# Altium schematic sheet 03_USB.SchDoc
size A2; ApprovedBy: DNP; CheckedBy: DNP; Author: DNP; CompanyName: Google LLC; DrawnBy: DNP; Engineer: Bangfei/Michael/Leo; Organization: Google LLC; Address1: 1600 Amphitheatre Parkway; Address2: Mountain View, CA 94043; Address3: DNP; Address4: DNP; DocumentNumber: DNP; Revision: PVT; SheetNumber: 3; SheetTotal: 11; VersionControl_RevNumber: DNP; IsUserConfigurable: DNP; Time: DNP; ImagePath: DNP; Rule: DNP; ProjectName: Enterprise; Application_BuildNumber: DNP
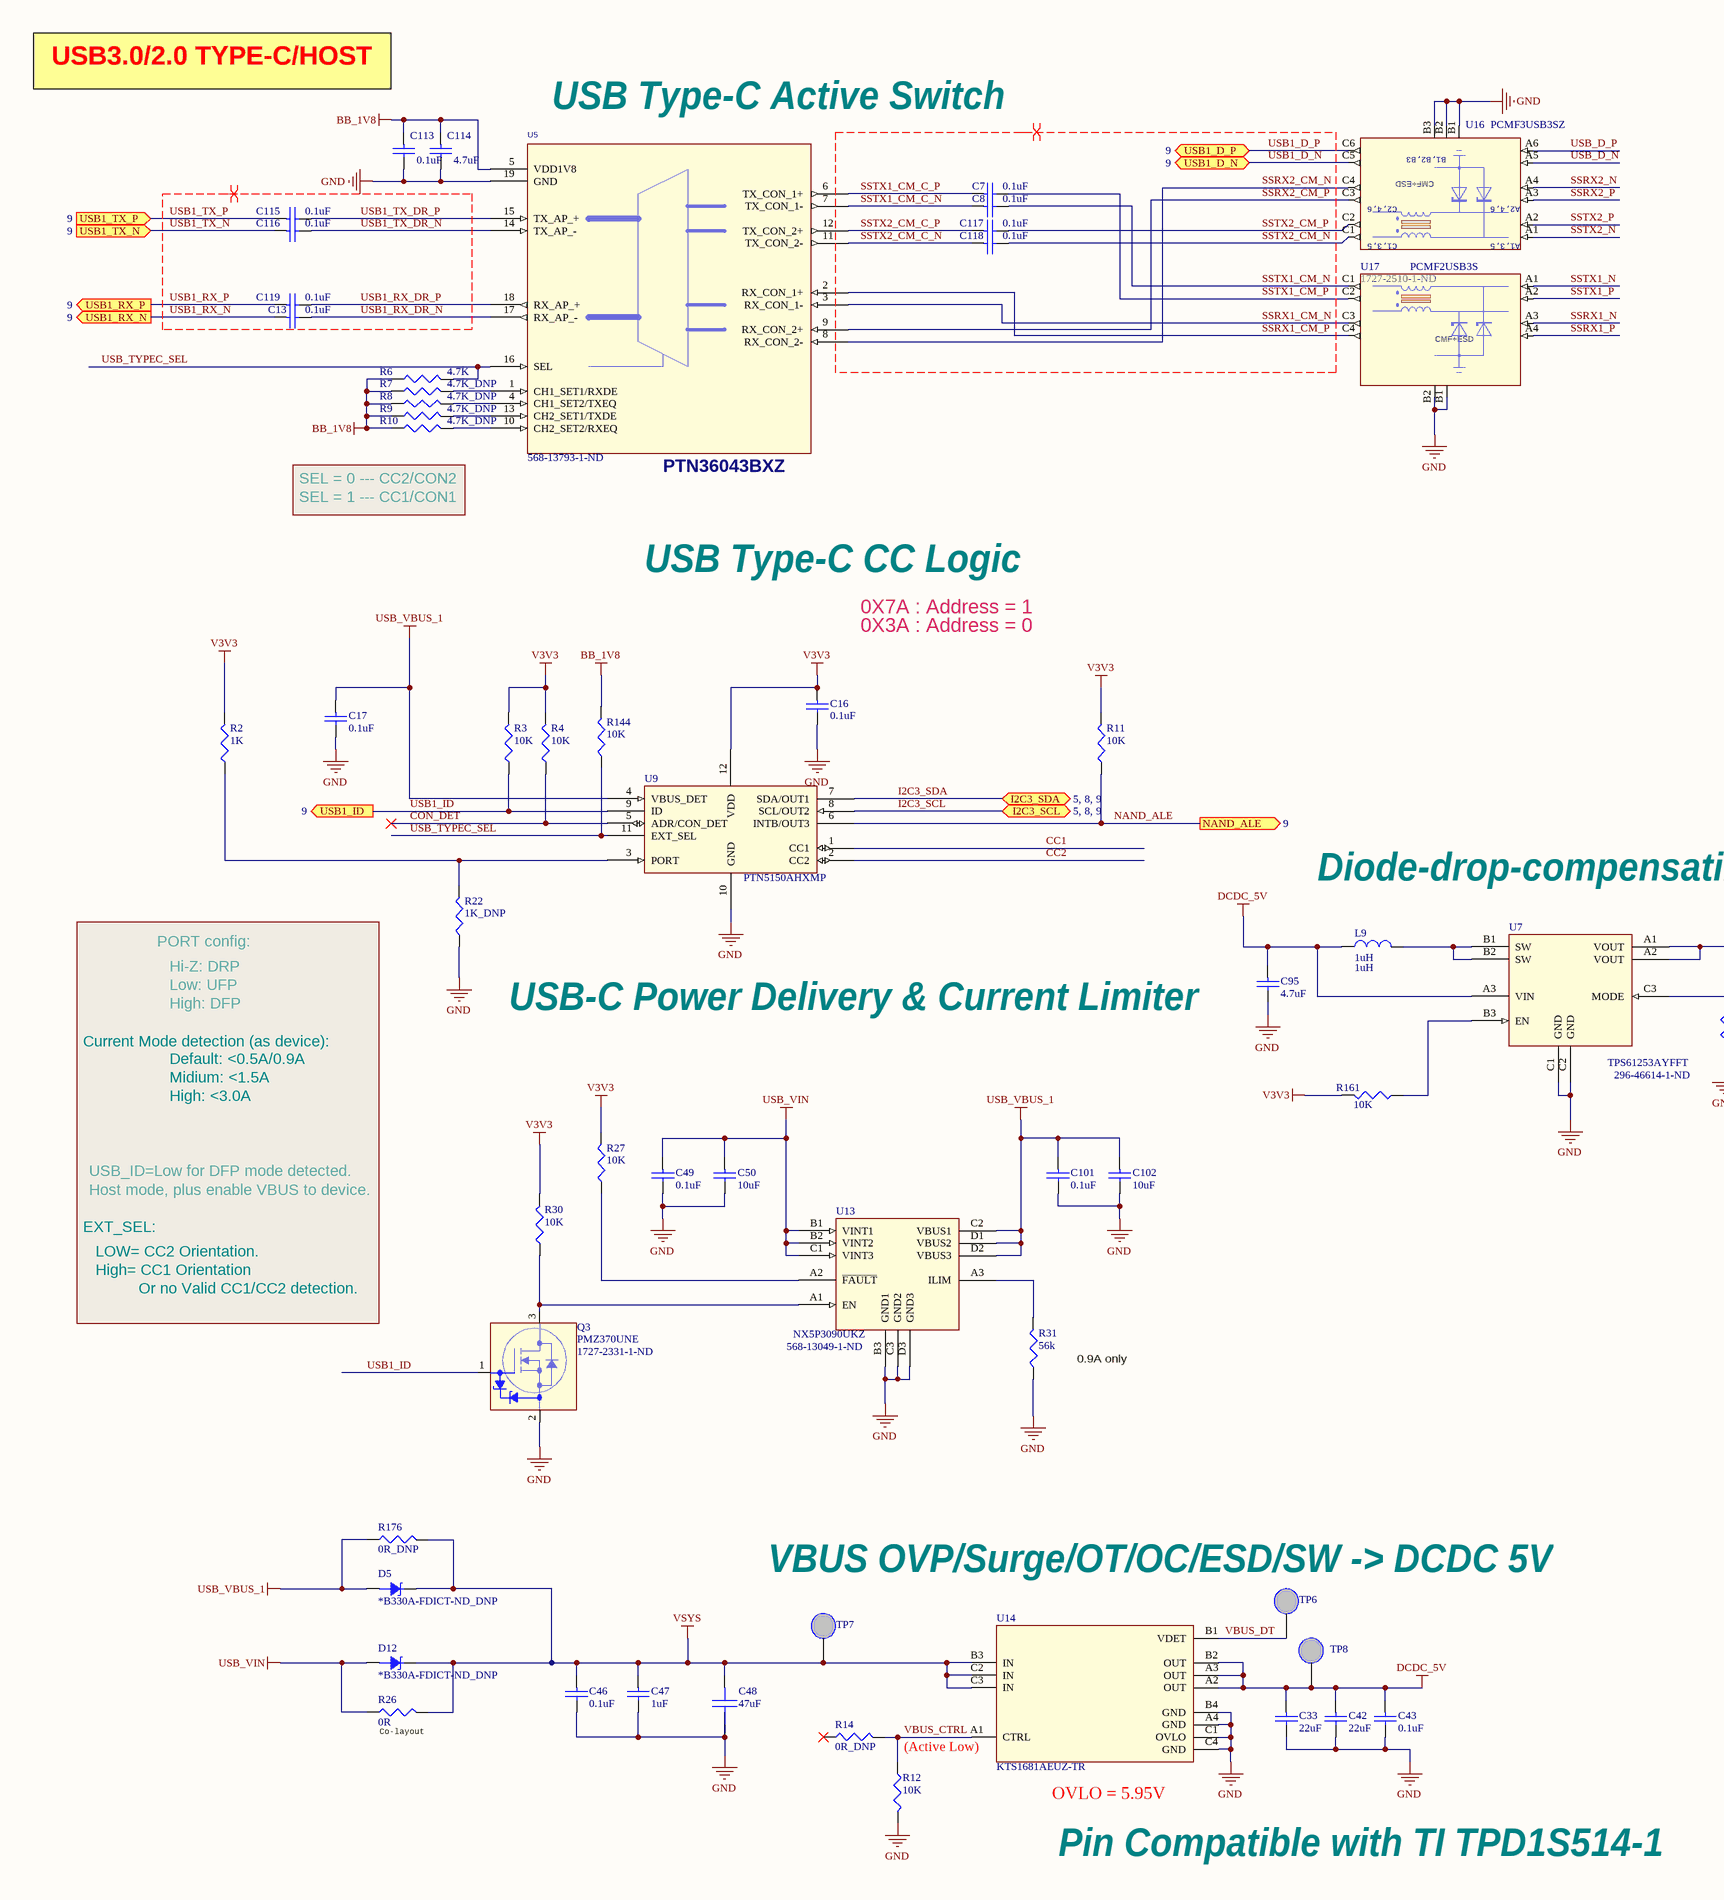
[diagram p0: 03_USB.SchDoc, left]
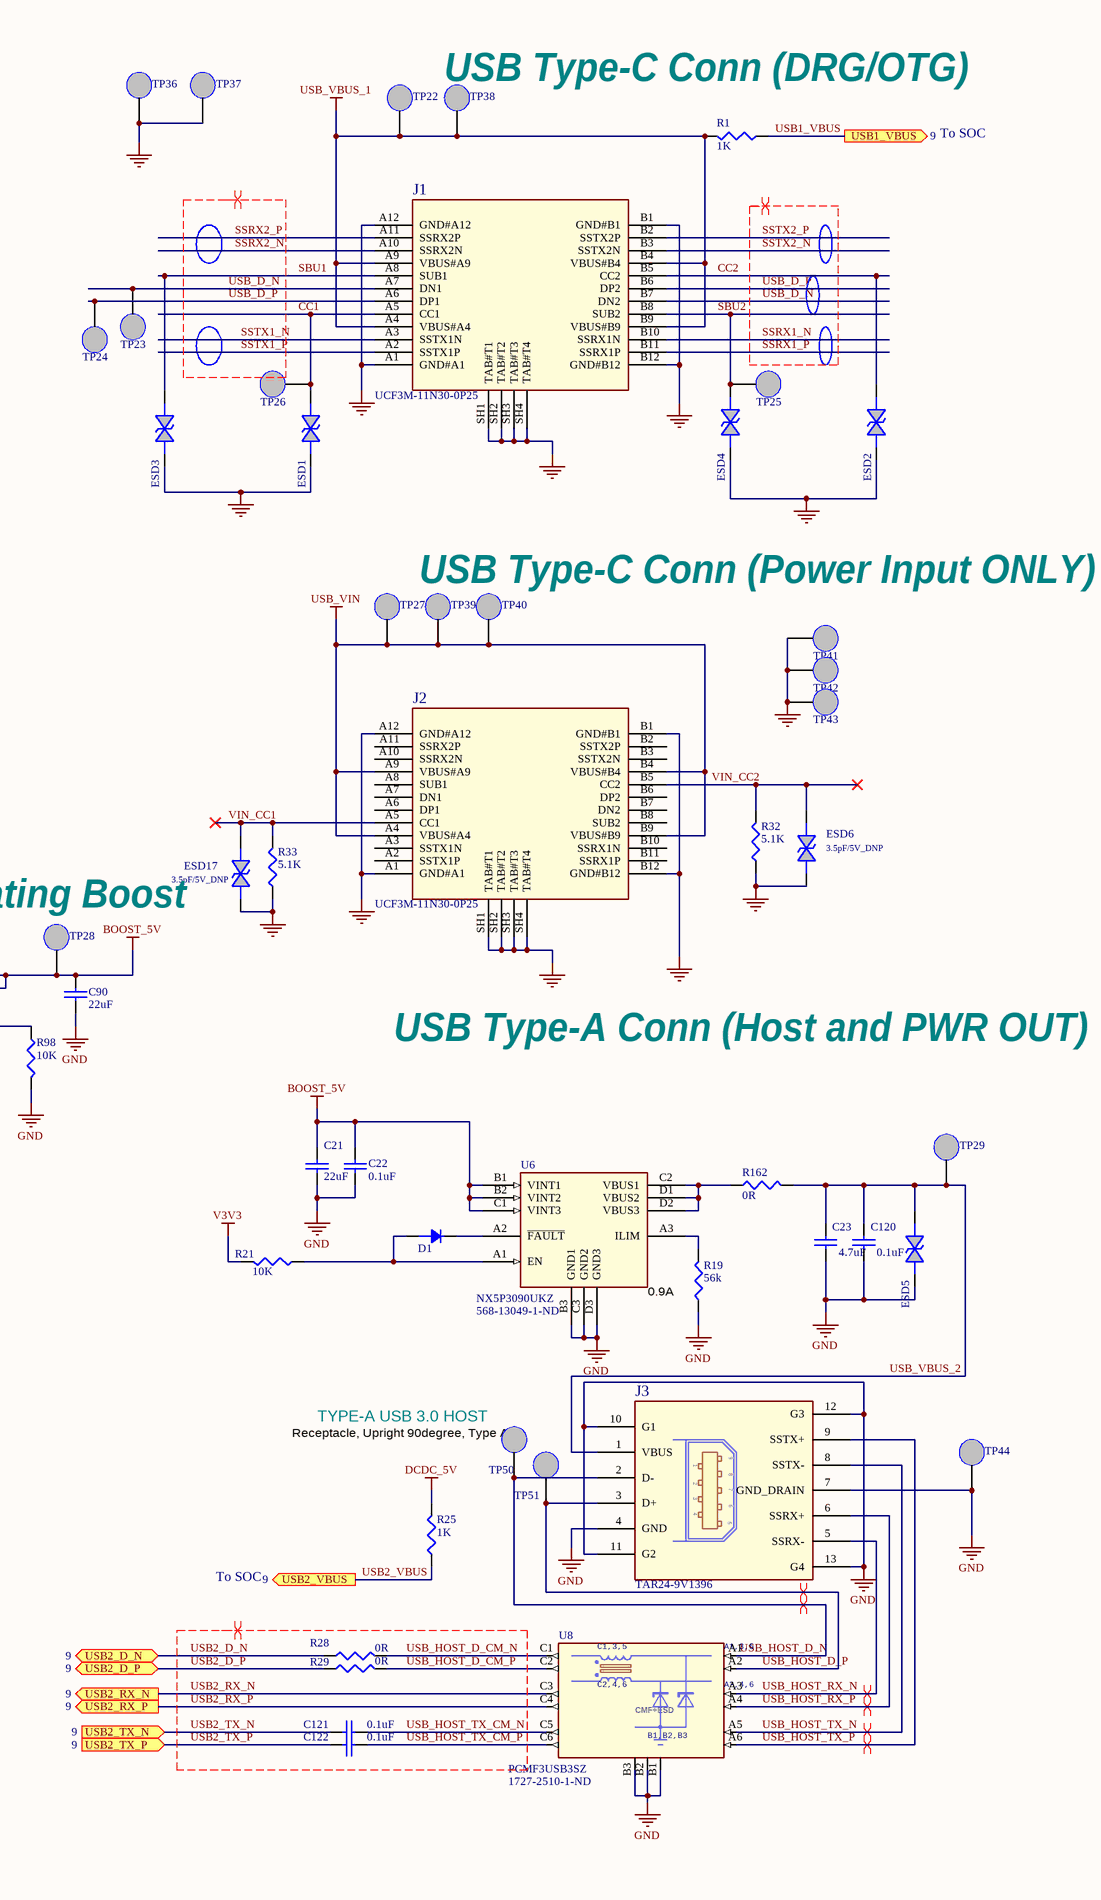
[diagram p1: 03_USB.SchDoc, right]

## Parts
C7  value 0.1uF  [0201]  (hidden comment: 0.1uF/10V)
C8  value 0.1uF  [0201]  (hidden comment: 0.1uF/10V)
C13  value 0.1uF  [0201]  (hidden comment: 0.1uF/10V)
C16  value 0.1uF  [0402]  (hidden comment: 0.1uF/25V)
C17  value 0.1uF  [0402]  (hidden comment: 0.1uF/25V)
C21  value 22uF  [0603]  (hidden comment: 22uF/10V)
C22  value 0.1uF  [0201]  (hidden comment: 0.1uF/10V)
C23  value 4.7uF  [0603]  (hidden comment: 4.7uF/10V)
C33  value 22uF  [0603]  (hidden comment: 22uF/10V)
C42  value 22uF  [0603]  (hidden comment: 22uF/10V)
C43  value 0.1uF  [0201]  (hidden comment: 0.1uF/10V)
C46  value 0.1uF  [0402]  (hidden comment: 0.1uF/25V)
C47  value 1uF  [0402]  (hidden comment: 1uF/25V)
C48  value 47uF  [1206]  (hidden comment: 47uF/25V)
C49  value 0.1uF  [0402]  (hidden comment: 0.1uF/25V)
C50  value 10uF  [0402]  (hidden comment: 10uF/10V)
C90  value 22uF  [0603]  (hidden comment: 10uF/10V)
C95  value 4.7uF  [0603]  (hidden comment: 4.7uF/10V)
C101  value 0.1uF  [0402]  (hidden comment: 0.1uF/25V)
C102  value 10uF  [0402]  (hidden comment: 10uF/10V)
C113  value 0.1uF  [0201]  (hidden comment: 0.1uF/10V)
C114  value 4.7uF  [0402]  (hidden comment: 4.7uF/10V)
C115  value 0.1uF  [0201]  (hidden comment: 0.1uF/10V)
C116  value 0.1uF  [0201]  (hidden comment: 0.1uF/10V)
C117  value 0.1uF  [0201]  (hidden comment: 0.1uF/10V)
C118  value 0.1uF  [0201]  (hidden comment: 0.1uF/10V)
C119  value 0.1uF  [0201]  (hidden comment: 0.1uF/10V)
C120  value 0.1uF  [0201]  (hidden comment: 0.1uF/10V)
C121  value 0.1uF  [0201]  (hidden comment: 0.1uF/10V)
C122  value 0.1uF  [0201]  (hidden comment: 0.1uF/10V)
D1  CUS10F30  [0805-Diode]  (value not drawn)
D5  Supplier Part Number 1: *B330A-FDICT-ND_DNP  [SMA-Diode]  (hidden comment: B330A-FDICT-ND_DNP)
D12  Supplier Part Number 1: *B330A-FDICT-ND_DNP  [SMA-Diode]  (hidden comment: B330A-FDICT-ND_DNP)
ESD1  3.5pF/5V  [0201]  (value not drawn)
ESD2  3.5pF/5V  [0201]  (value not drawn)
ESD3  3.5pF/5V  [0201]  (value not drawn)
ESD4  3.5pF/5V  [0201]  (value not drawn)
ESD5  3.5pF/5V  [0201]  (value not drawn)
ESD6  3.5pF/5V_DNP  [0201]
ESD17  3.5pF/5V_DNP  [0201]
J1  UCF3M-11N30-0P25  [USB12_0_5-UCF3M-11N30-0P25]
J2  UCF3M-11N30-0P25  [USB12_0_5-UCF3M-11N30-0P25]
J3  TAR24-9V1396  [USB9-3_0-TAR24-9V1396]
L9  1uH  [INDC2016X12L]
Q3  PMZ370UNE  Supplier Part Number 1: 1727-2331-1-ND  [DFN10106B]
R1  value 1K  [0201]  (hidden comment: 1K/1%)
R2  value 1K  [0201]  (hidden comment: 1K/1%)
R3  10K  [0201]
R4  10K  [0201]
R6  4.7K  [0201]
R7  value 4.7K_DNP  [0201]  (hidden comment: 4.7K)
R8  value 4.7K_DNP  [0201]  (hidden comment: 4.7K)
R9  value 4.7K_DNP  [0201]  (hidden comment: 4.7K)
R10  value 4.7K_DNP  [0201]  (hidden comment: 4.7K)
R11  10K  [0201]
R12  10K  [0201]
R14  0R_DNP  [0201]
R19  56k  [0402]
R21  10K  [0201]
R22  1K_DNP  [0201]
R25  value 1K  [0201]  (hidden comment: 1K/1%)
R26  0R  [1206]
R27  10K  [0201]
R28  0R  [0201]
R29  0R  [0201]
R30  10K  [0201]
R31  56k  [0402]
R32  5.1K  [0201]
R33  5.1K  [0201]
R98  10K  [0201]
R144  10K  [0201]
R161  10K  [0201]
R162  0R  [0402]
R176  value 0R_DNP  [1206]  (hidden comment: 0R)
TP6  TP NM  [TP_SMD_L]  (value not drawn)  (no BOM)
TP7  TP NM  [TP_SMD_L]  (value not drawn)  (no BOM)
TP8  TP NM  [TP_SMD_L]  (value not drawn)  (no BOM)
TP22  TP NM  [TP_SMD_L]  (value not drawn)  (no BOM)
TP23  TP NM  [TP_SMD]  (value not drawn)  (no BOM)
TP24  TP NM  [TP_SMD]  (value not drawn)  (no BOM)
TP25  TP NM  [TP_SMD]  (value not drawn)  (no BOM)
TP26  TP NM  [TP_SMD]  (value not drawn)  (no BOM)
TP27  TP NM  [TP_SMD_L]  (value not drawn)  (no BOM)
TP28  TP NM  [TP_SMD_L]  (value not drawn)  (no BOM)
TP29  TP NM  [TP_SMD_L]  (value not drawn)  (no BOM)
TP36  TP NM  [TP_SMD_L]  (value not drawn)  (no BOM)
TP37  TP NM  [TP_SMD_L]  (value not drawn)  (no BOM)
TP38  TP NM  [TP_SMD_L]  (value not drawn)  (no BOM)
TP39  TP NM  [TP_SMD_L]  (value not drawn)  (no BOM)
TP40  TP NM  [TP_SMD_L]  (value not drawn)  (no BOM)
TP41  TP NM  [TP_SMD_L]  (value not drawn)  (no BOM)
TP42  TP NM  [TP_SMD_L]  (value not drawn)  (no BOM)
TP43  TP NM  [TP_SMD_L]  (value not drawn)  (no BOM)
TP44  TP NM  [TP_SMD_L]  (value not drawn)  (no BOM)
TP50  TP NM  [TP_SMD_L]  (value not drawn)  (no BOM)
TP51  TP NM  [TP_SMD_L]  (value not drawn)  (no BOM)
U5  PTN36043BXZ  Supplier Part Number 1: 568-13793-1-ND  [DHXQFN18_0P4_2X2P45]
U6  NX5P3090UKZ  Supplier Part Number 1: 568-13049-1-ND  [WLCSP12_0P4_1P38X1P68MM_SMDP]
U7  TPS61253AYFFT  Supplier Part Number 1: 296-46614-1-ND  [WLCSP_BGA3x3]
U8  PCMF3USB3SZ  Supplier Part Number 1: 1727-2510-1-ND  [WLCSP15_0P4_2P42X1P22_SMDP]
U9  PTN5150AHXMP  [X2QFN12_0P4_1P6X1P6]
U13  NX5P3090UKZ  Supplier Part Number 1: 568-13049-1-ND  [WLCSP12_0P4_1P38X1P68MM_SMDP]
U14  KTS1681AEUZ-TR  [WLCSP_BGA3x4]
U16  PCMF3USB3SZ  Supplier Part Number 1: 1727-2510-1-ND  [WLCSP15_0P4_2P42X1P22_SMDP]
U17  PCMF2USB3S  [WLCSP10_0P4_1P2X1P6MM_SMDP]

## Ports
I2C3_SCL (bidir, see 5, 8, 9), I2C3_SDA (bidir, see 5, 8, 9), NAND_ALE (out, see 9), USB1_D_N (bidir, see 9), USB1_D_P (bidir, see 9), USB1_ID (out, see 9), USB1_RX_N (out, see 9), USB1_RX_P (out, see 9), USB1_TX_N (in, see 9), USB1_TX_P (in, see 9), USB1_VBUS (out, see 9), USB2_D_N (bidir, see 9), USB2_D_P (bidir, see 9), USB2_RX_N (out, see 9), USB2_RX_P (out, see 9), USB2_TX_N (in, see 9), USB2_TX_P (in, see 9), USB2_VBUS (out, see 9)

## Nets
BB_1V8: C113.1 C114.1 R6.1 R7.1 R8.1 R9.1 R10.1 R144.2 U5.5(VDD1V8)
BOOST_5V: C21.1 C22.1 C90.1 TP28.1 U6.B1(VINT1) U6.B2(VINT2) U6.C1(VINT3) U7.A1(VOUT) U7.A2(VOUT)
DCDC_5V: C33.1 C42.1 C43.1 C95.1 L9.1 R25.2 TP8.1 U7.A3(VIN) U14.A2(OUT) U14.A3(OUT) U14.B2(OUT)
GND: C16.2 C17.2 C21.2 C22.2 C23.2 C33.2 C42.2 C43.2 C46.2 C47.2 C48.2 C49.2 C50.2 C90.2 C95.2 C101.2 C102.2 C113.2 C114.2 C120.2 ESD1.1 ESD2.1 ESD3.1 ESD4.1 ESD5.1 ESD6.1 ESD17.1 J1.A1(GND#A1) J1.A12(GND#A12) J1.B1(GND#B1) J1.B12(GND#B12) J1.SH1(TAB#T1) J1.SH2(TAB#T2) J1.SH3(TAB#T3) J1.SH4(TAB#T4) J2.A1(GND#A1) J2.A12(GND#A12) J2.B1(GND#B1) J2.B12(GND#B12) J2.SH1(TAB#T1) J2.SH2(TAB#T2) J2.SH3(TAB#T3) J2.SH4(TAB#T4) J3.4(GND) J3.7(GND_DRAIN) J3.10(G1) J3.11(G2) J3.12(G3) J3.13(G4) Q3.2(SOURCE) R12.2 R19.1 R22.1 R31.1 R32.1 R33.1 R98.2 TP36.1 TP37.1 TP41.1 TP42.1 TP43.1 TP44.1 U5.19(GND) U6.B3(GND1) U6.C3(GND2) U6.D3(GND3) U7.C1(GND) U7.C2(GND) U8.B1(GND_CH1) U8.B2(GND_CH2) U8.B3(GND_CH3) U9.10(GND) U13.B3(GND1) U13.C3(GND2) U13.D3(GND3) U14.A4(GND) U14.B4(GND) U14.C1(OVLO) U14.C4(GND) U16.B1(GND_CH1) U16.B2(GND_CH2) U16.B3(GND_CH3) U17.B1(GND_CH1) U17.B2(GND_CH2)
USB_VBUS_1: C17.1 C101.1 C102.1 D5.A J1.A4(VBUS#A4) J1.A9(VBUS#A9) J1.B4(VBUS#B4) J1.B9(VBUS#B9) R1.2 R176.1 TP22.1 TP38.1 U9.4(VBUS_DET) U13.C2(VBUS1) U13.D1(VBUS2) U13.D2(VBUS3)
USB_VIN: C49.1 C50.1 D12.A J2.A4(VBUS#A4) J2.A9(VBUS#A9) J2.B4(VBUS#B4) J2.B9(VBUS#B9) R26.1 TP27.1 TP39.1 TP40.1 U13.B1(VINT1) U13.B2(VINT2) U13.C1(VINT3)
V3V3: C16.1 R2.2 R3.2 R4.2 R11.2 R21.2 R27.2 R30.2 R161.2 U9.12(VDD)
VSYS: C46.1 C47.1 C48.1 D5.C D12.C R26.2 R176.2 TP7.1 U14.B3(IN) U14.C2(IN) U14.C3(IN)
CC1: ESD1.2 J1.A5(CC1) TP26.1 U9.1(CC1)
CC2: ESD2.2 J1.B5(CC2) U9.2(CC2)
CON_DET: R4.1 U9.5(ADR/CON_DET)
I2C3_SCL: U9.8(SCL/OUT2) ; port I2C3_SCL
I2C3_SDA: U9.7(SDA/OUT1) ; port I2C3_SDA
NAND_ALE: R11.1 U9.6(INTB/OUT3) ; port NAND_ALE
SBU1: ESD3.2 J1.A8(SUB1)
SBU2: ESD4.2 J1.B8(SUB2) TP25.1
SSRX1_CM_N: U5.3(RX_CON_1-) U17.C3(CH2_OUT+)
SSRX1_CM_P: U5.2(RX_CON_1+) U17.C4(CH2_OUT-)
SSRX1_N: J1.B10(SSRX1N) U17.A3(CH2_IN+)
SSRX1_P: J1.B11(SSRX1P) U17.A4(CH2_IN-)
SSRX2_CM_N: U5.8(RX_CON_2-) U16.C4(CH2_OUT-)
SSRX2_CM_P: U5.9(RX_CON_2+) U16.C3(CH2_OUT+)
SSRX2_N: J1.A10(SSRX2N) U16.A4(CH2_IN-)
SSRX2_P: J1.A11(SSRX2P) U16.A3(CH2_IN+)
SSTX1_CM_C_N: C8.1 U5.7(TX_CON_1-)
SSTX1_CM_C_P: C7.1 U5.6(TX_CON_1+)
SSTX1_CM_N: C8.2 U17.C1(CH1_OUT+)
SSTX1_CM_P: C7.2 U17.C2(CH1_OUT-)
SSTX1_N: J1.A3(SSTX1N) U17.A1(CH1_IN+)
SSTX1_P: J1.A2(SSTX1P) U17.A2(CH1_IN-)
SSTX2_CM_C_N: C118.1 U5.11(TX_CON_2-)
SSTX2_CM_C_P: C117.1 U5.12(TX_CON_2+)
SSTX2_CM_N: C118.2 U16.C1(CH1_OUT+)
SSTX2_CM_P: C117.2 U16.C2(CH1_OUT-)
SSTX2_N: J1.B3(SSTX2N) U16.A1(CH1_IN+)
SSTX2_P: J1.B2(SSTX2P) U16.A2(CH1_IN-)
USB1_D_N: U16.C5(CH3_OUT+) ; port USB1_D_N
USB1_D_P: U16.C6(CH3_OUT-) ; port USB1_D_P
USB1_ID: Q3.1(GATE) R3.1 U9.9(ID) ; port USB1_ID
USB1_RX_DR_N: C13.2 U5.17(RX_AP_-)
USB1_RX_DR_P: C119.2 U5.18(RX_AP_+)
USB1_RX_N: C13.1 ; port USB1_RX_N
USB1_RX_P: C119.1 ; port USB1_RX_P
USB1_TX_DR_N: C116.2 U5.14(TX_AP_-)
USB1_TX_DR_P: C115.2 U5.15(TX_AP_+)
USB1_TX_N: C116.1 ; port USB1_TX_N
USB1_TX_P: C115.1 ; port USB1_TX_P
USB1_VBUS: R1.1 ; port USB1_VBUS
USB2_D_N: R28.1 ; port USB2_D_N
USB2_D_P: R29.1 ; port USB2_D_P
USB2_RX_N: U8.C3(CH2_OUT+) ; port USB2_RX_N
USB2_RX_P: U8.C4(CH2_OUT-) ; port USB2_RX_P
USB2_TX_N: C121.1 ; port USB2_TX_N
USB2_TX_P: C122.1 ; port USB2_TX_P
USB2_VBUS: R25.1 ; port USB2_VBUS
USB_D_N: J1.A7(DN1) J1.B7(DN2) TP23.1 U16.A5(CH3_IN+)
USB_D_P: J1.A6(DP1) J1.B6(DP2) TP24.1 U16.A6(CH3_IN-)
USB_HOST_D_CM_N: R28.2 U8.C1(CH1_OUT+)
USB_HOST_D_CM_P: R29.2 U8.C2(CH1_OUT-)
USB_HOST_D_N: J3.2(D-) TP50.1 U8.A1(CH1_IN+)
USB_HOST_D_P: J3.3(D+) TP51.1 U8.A2(CH1_IN-)
USB_HOST_RX_N: J3.5(SSRX-) U8.A3(CH2_IN+)
USB_HOST_RX_P: J3.6(SSRX+) U8.A4(CH2_IN-)
USB_HOST_TX_CM_N: C121.2 U8.C5(CH3_OUT+)
USB_HOST_TX_CM_P: C122.2 U8.C6(CH3_OUT-)
USB_HOST_TX_N: J3.8(SSTX-) U8.A5(CH3_IN+)
USB_HOST_TX_P: J3.9(SSTX+) U8.A6(CH3_IN-)
USB_TYPEC_SEL: R6.2 R144.1 U5.16(SEL) U9.11(EXT_SEL)
USB_VBUS_2: C23.1 C120.1 ESD5.2 J3.1(VBUS) R162.2 TP29.1
VBUS_CTRL: R12.1 R14.2 U14.A1(CTRL)
VBUS_DT: TP6.1 U14.B1(VDET)
VIN_CC1: ESD17.2 J2.A5(CC1) R33.2
VIN_CC2: ESD6.2 J2.B5(CC2) R32.2
NetD1_A: D1.A R21.1 U6.A1(EN)
NetD1_K: D1.K U6.A2(~{FAULT})
NetL9_2: L9.2 U7.B1(SW) U7.B2(SW)
NetQ3_3: Q3.3(DRAIN) R30.1 U13.A1(EN)
NetR2_1: R2.1 R22.2 U9.3(PORT)
NetR7_2: R7.2 U5.1(CH1_SET1/RXDE)
NetR8_2: R8.2 U5.4(CH1_SET2/TXEQ)
NetR9_2: R9.2 U5.13(CH2_SET1/TXDE)
NetR10_2: R10.2 U5.10(CH2_SET2/RXEQ)
NetR19_2: R19.2 U6.A3(ILIM)
NetR27_1: R27.1 U13.A2(~{FAULT})
NetR31_2: R31.2 U13.A3(ILIM)
NetR98_1: R98.1 U7.C3(MODE)
NetR161_1: R161.1 U7.B3(EN)
NetR162_1: R162.1 U6.C2(VBUS1) U6.D1(VBUS2) U6.D2(VBUS3)

Not connected (* = marked no-connect by the designer): J2 A2(SSTX1P) A3(SSTX1N) A6(DP1) A7(DN1) A8(SUB1) A10(SSRX2N) A11(SSRX2P) B2(SSTX2P) B3(SSTX2N) B6(DP2) B7(DN2) B8(SUB2) B10(SSRX1N) B11(SSRX1P); R14 1*

## Layout directives
differential pair: SSRX1_CM_N, SSRX1_CM_P, SSRX1_N, SSRX1_P, SSRX2_CM_N, SSRX2_CM_P, SSRX2_N, SSRX2_P, SSTX1_CM_C_N, SSTX1_CM_C_P, SSTX1_CM_N, SSTX1_CM_P, SSTX1_N, SSTX1_P, SSTX2_CM_C_N, SSTX2_CM_C_P, SSTX2_CM_N, SSTX2_CM_P, SSTX2_N, SSTX2_P, USB1_D_N, USB1_D_P, USB1_RX_DR_N, USB1_RX_DR_P, USB1_RX_N, USB1_RX_P, USB1_TX_DR_N, USB1_TX_DR_P, USB1_TX_N, USB1_TX_P, USB2_D_N, USB2_D_P, USB2_RX_N, USB2_RX_P, USB2_TX_N, USB2_TX_P, USB_D_N, USB_D_P, USB_HOST_D_CM_N, USB_HOST_D_CM_P, USB_HOST_D_N, USB_HOST_D_P, USB_HOST_RX_N, USB_HOST_RX_P, USB_HOST_TX_CM_N, USB_HOST_TX_CM_P, USB_HOST_TX_N, USB_HOST_TX_P

## Notes on the sheet
- USB3.0/2.0 TYPE-C/HOST
- (near TP38) USB Type-C Conn (DRG/OTG)
- USB Type-C Active Switch
- To SOC
- SEL = 0 --- CC2/CON2
- SEL = 1 --- CC1/CON1
- USB Type-C CC Logic
- USB Type-C Conn (Power Input ONLY)
- 0X7A : Address = 1
- 0X3A : Address = 0
- Diode-drop-compensating Boost
- PORT config:
- Hi-Z: DRP
- Low: UFP
- High: DFP
- (near C95) USB-C Power Delivery & Current Limiter
- USB Type-A Conn (Host and PWR OUT)
- Current Mode detection (as device):
- Default: <0.5A/0.9A
- Midium: <1.5A
- High: <3.0A
- USB_ID=Low for DFP mode detected.
- Host mode, plus enable VBUS to device.
- EXT_SEL:
- LOW= CC2 Orientation.
- High= CC1 Orientation
- (near U6) 0.9A
- Or no Valid CC1/CC2 detection.
- (near R31) 0.9A only
- TYPE-A USB 3.0 HOST
- (near TP50) Receptacle, Upright 90degree, Type A
- (near TP6) VBUS OVP/Surge/OT/OC/ESD/SW -> DCDC 5V
- (near R26) Co-layout
- (Active Low)
- (near U14) OVLO = 5.95V
- Pin Compatible with TI TPD1S514-1
- Project:
- Engineer:
- Date:
- File:
- Revision:
- Sheet
- of
- (in symbol PCMF2USB3S_10P) CMF+ESD
- (in symbol PCMF3USB3S_A) C1,3,5; A1,3,5; C2,4,6; A2,4,6; CMF+ESD; B1,B2,B3

## Library data of the parts
C7 C8 C13 C113 C115-C119 = CAP_0201_0.1uF: CAP CER 0.1UF 10V 10% X5R 0201; MPN: C0603X5R1A104K030BC; QCI MPN: GRM033R61A104K; QPN: CH4102K9E00; QPN Description: CAP CHIP 0.1U 10V(+-10%,X5R,0201); Function Code: HUB; Supplier 1: Digi-Key; Supplier Part Number 1: 445-7318-1-ND; QCI Supplier: MUR
C16 C17 = CAP_0402_0.1uF_25V: CAP CER 0.1uF 25V 10% X7R 0402; MPN: TMK105BJ104KV-F; QCI MPN: GRM155R71E104K; QPN: CH4104K1B00; QPN Description: CAP CHIP 0.1U 25V(+-10%,X7R,0402); Function Code: HUB; Supplier 1: Digi-Key; Supplier Part Number 1: 587-1456-1-ND; QCI Supplier: MUR
C21 C33 C42 = CAP_0603_22uF: CAP CER 22UF 6.3V 10% X5R 0603; MPN: CL10A226KQ8NRNE; QCI MPN: GRM188R61A226M; QPN: CH6222M9901; QPN Description: CAP CHIP 22UF 10V(+-20%,X5R,0603); Function Code: USB; Supplier 1: Digi-Key; Supplier Part Number 1: 1276-2867-2-ND; QCI Supplier: MUR
C22 C43 C120-C122 = CAP_0201_0.1uF: CAP CER 0.1UF 10V 10% X5R 0201; MPN: C0603X5R1A104K030BC; QCI MPN: GRM033R61A104K; QPN: CH4102K9E00; QPN Description: CAP CHIP 0.1U 10V(+-10%,X5R,0201); Function Code: USB; Supplier 1: Digi-Key; Supplier Part Number 1: 445-7318-1-ND; QCI Supplier: MUR
C23 = CAP_0603_4.7uF: CAP CER 4.7uF 10V 10% X5R 0603; MPN: CGB3B1X5R1A475K055AC; QCI MPN: GRM188C71A475K; QPN: CH5472M6900; QPN Description: CAP CHIP 4.7UF 10V(+-10%,X7S,0603); Function Code: USB; Supplier 1: Digi-Key; Supplier Part Number 1: 445-7482-1-ND; QCI Supplier: MUR
C46 C49 C101 = CAP_0402_0.1uF_25V: CAP CER 0.1uF 25V 10% X7R 0402; MPN: TMK105BJ104KV-F; QCI MPN: GRM155R71E104K; QPN: CH4104K1B00; QPN Description: CAP CHIP 0.1U 25V(+-10%,X7R,0402); Function Code: USB; Supplier 1: Digi-Key; Supplier Part Number 1: 587-1456-1-ND; QCI Supplier: MUR
C47 = CAP_0402_1.0uF_25V: CAP CER 1.0UF 25V 10% X5R 0402; MPN: TMK105BJ105MV-F; QCI MPN: GRM155R61E105K; QPN: CH5104K9B01; QPN Description: CAP CHIP 1UF 25V(+-10%,X5R,0402); Function Code: USB; Supplier 1: Digi-Key; Supplier Part Number 1: 587-3245-1-ND; QCI Supplier: MUR
C48 = CAP_1206_47uF_25V: CAP CER 47UF 25V 20% 1206; MPN: C3216JB1E476M160AC; Function Code: USB; Supplier 1: Digi-Key; Supplier Part Number 1: 445-11717-1-ND
C50 C102 = CAP_0603_4.7uF_35V: CAP CER 10UF 10V 20% X5R 0402; MPN: CL05A106MP5NUNC; QCI MPN: GRM155R61A106M; QPN: CH6102M9B00; QPN Description: CAP CHIP 10U 10V (+-20%, X5R, 0402)'; Function Code: USB; Supplier 1: Digi-Key; Supplier Part Number 1: 1276-1450-1-ND; QCI Supplier: MUR
C90 = CAP_0603_22uF: CAP CER 22UF 6.3V 10% X5R 0603; MPN: CL10A226KQ8NRNE; QCI MPN: GRM188R61A106M; QPN: CH6102M9900; QPN Description: CAP CHIP 10U 10V(+-20%,X5R,0603); Function Code: USB; Supplier 1: Digi-Key; Supplier Part Number 1: 1276-2867-2-ND; QCI Supplier: MUR
C95 = CAP_0603_4.7uF: CAP CER 4.7uF 10V 10% X5R 0603; MPN: CGB3B1X5R1A475K055AC; QCI MPN: GRM188C71A475K; QPN: CH5472M6900; QPN Description: CAP CHIP 4.7UF 10V(+-10%,X7S,0603); Function Code: DCD; Supplier 1: Digi-Key; Supplier Part Number 1: 445-7482-1-ND; QCI Supplier: MUR
C114 = CAP_0402_4.7uF: CAP CER 4.7UF 10V 20% X5R 0402; MPN: C1005X5R1A475M050BC; QCI MPN: GRM155R61A475M; QPN: CH5472M9B01; QPN Description: CAP CHIP 4.7U 10V(+-20%,X5R,0402); Function Code: HUB; Supplier 1: Digi-Key; Supplier Part Number 1: 445-8023-1-ND; QCI Supplier: MUR
D1 = Diode_Schottky_0805: DIODE SCHOTTKY 20V 1A 0805; Function Code: USB; QPN: BC0CUS10000; QPN Description: DIODE SMD SCHOTTKY  CUS10F30(30V,1A); Supplier 1: Digi-Key; Supplier Part Number 1: 478-7800-1-ND; QCI Supplier: TOS; MPN: CUS10F30; QCI MPN: CUS10F30
D5 D12 = Diode_Schottky_B330A-13-F: Function Code: USB; DNP: V; Supplier 1: Digi-Key; QCI Supplier: Diodes; MPN: B330A-FDICT-ND
ESD1-ESD5 = DIODE BI-DIR TRIG: DIODE TVS 15kV 10V 50A 8pF SMT RoHS; MPN: DESD5V0V1BCSP-7; QPN: BC5V0V1BZ02; QPN Description: DIODE ESD SMD DESD5V0V1BCSP-7 6V,DSN0603; Function Code: USB; QCI MPN: DESD5V0V1BCSP-7; QCI Supplier: DDS
ESD6 ESD17 = DIODE BI-DIR TRIG: DIODE TVS 15kV 10V 50A 8pF SMT RoHS; MPN: DESD5V0V1BCSP-7; QPN: BC5V0V1BZ02; QPN Description: DIODE ESD SMD DESD5V0V1BCSP-7 6V,DSN0603; Function Code: USB; DNP: V; QCI MPN: DESD5V0V1BCSP-7; QCI Supplier: DDS
J1 J2 = CONN_USBC_RCPT_UCF3M-11N30-0P25: QPN: DFHS24FR262; QPN Description: CONN SMD USB3.1C 24P 2R FR(P0.5,H2.38); Function Code: USB; QCI Supplier: LTK; MPN: UCF3M-11N30-0P25; QCI MPN: UCF3M-11N30-0P25; Supplier Part Number 1: UCF3M-11N30-0P25
J3 = CONN_USBA_ACON_TAR24-9V1396: CONN, USB TYPE A, 3.0 REC TH; QPN: DFHS09FR696; QPN Description: CONN DIP USB3.0 9P 2R FR(P1.0,H5.76); QCI Supplier: CAN; MPN: TAR24-9V1396; QCI MPN: TAR24-9V1396; Function Code: USB
L9 = INDUCTOR_VLS201612HBX-1R0M-1: FIXED IND 1UH 2.7A 72 MOHM SMD; QPN: TV-1024MZ03; QPN Description: IND SMD 1U 20% 2.42A VLS201612HBX E-SEL; Function Code: DCD; Supplier 1: Digi-Key; Supplier Part Number 1: 445-173010-1-ND; Value: 1uH; MPN: VLS201612HBX-1R0M-1; QCI MPN: VLS201612HBX-1R0M-1; QCI Supplier: TDK
Q3 = NMOS_NX3008NBK: N-Channel 30V 590mA, SMT DFN1006B-3; MPN: PMZB550UNEYL; Function Code: USB; QPN: BAM03700000; QPN Description: TRANS MOSFET PMZ370UNE (30V,0.9 A,0.36W); Supplier 1: Digi-Key; QCI MPN: PMZ370UNE; QCI Supplier: NXP
R1 R25 = R_0201_1K: RES SMD 1K OHM 1% 1/20W 0201; MPN: ERJ-1GEF1001C; QCI MPN: RC0201FR-131KL; QPN: CS21001FE04; QPN Description: RES CHIP 1K 1/20W +-1%(0201); Function Code: USB; Supplier 1: Digi-Key; Supplier Part Number 1: P1.00KABCT-ND; QCI Supplier: YGO
R2 = R_0201_1K: RES SMD 1K OHM 1% 1/20W 0201; MPN: ERJ-1GEF1001C; QCI MPN: RC0201FR-131KL; QPN: CS21001FE04; QPN Description: RES CHIP 1K 1/20W +-1%(0201); Function Code: HUB; Supplier 1: Digi-Key; Supplier Part Number 1: P1.00KABCT-ND; QCI Supplier: YGO
R3 R4 R11 R144 = R_0201_10K: RES SMD 10K OHM JUMPER 1/20W  0201; MPN: ERJ-1GEF103C; QCI MPN: RC0201JR-1310KL; QPN: CS31001JE16; QPN Description: RES CHIP 10K 1/20W +-5%(0201); Function Code: HUB; Supplier 1: Digi-Key; VALUE: 10K; Supplier Part Number 1: P10.0KABCT-ND; QCI Supplier: YGO
R6-R10 = R_0201_4.7K: RES SMD 4.7K OHM 1% 1/20W 0201; MPN: ERJ-1GEF4701C; QCI MPN: RC0201FR-134K7L; QPN: CS24701FE00; QPN Description: RES CHIP 4.7K 1/20W +-1%(0201; Function Code: HUB; Supplier 1: Digi-Key; Supplier Part Number 1: P4.70KABCT-ND; QCI Supplier: YGO
  R6: VALUE: 4.7K
R12 R21 R27 R30 = R_0201_10K: RES SMD 10K OHM JUMPER 1/20W  0201; MPN: ERJ-1GEF103C; QCI MPN: RC0201JR-1310KL; QPN: CS31001JE16; QPN Description: RES CHIP 10K 1/20W +-5%(0201); Function Code: USB; Supplier 1: Digi-Key; VALUE: 10K; Supplier Part Number 1: P10.0KABCT-ND; QCI Supplier: YGO
R14 = R_0201_0: RES SMD 0.0OHM JUMPER 1/20W 0201; MPN: ERJ-1GN0R00C; QCI MPN: RC0201JR-130RL; DNP: V; QPN: CS00001JE18; QPN Description: RES CHIP 0(1/20W,+-5%,0201); Function Code: USB; Supplier 1: Digi-Key; Supplier Part Number 1: P15979CT-ND; VALUE: 0R_DNP; QCI Supplier: YGO
R19 R31 = R_0402_56k: RES SMD 56K OHM 1% 1/10W 0402; MPN: ERJ-2RKF5602X; QCI MPN: RC0402FR-0756K; QPN: CS35602FB02; QPN Description: RES CHIP 56K 1/16W +-1%(0402); Function Code: USB; Supplier 1: Digi-Key; Supplier Part Number 1: P56.0KLCT-ND; VALUE: 56k; QCI Supplier: YGO
R22 = R_0201_1K: RES SMD 1K OHM 1% 1/20W 0201; MPN: ERJ-1GEF1001C; QCI MPN: RC0201FR-131KL; DNP: V; QPN: CS21001FE04; QPN Description: RES CHIP 1K 1/20W +-1%(0201); Function Code: HUB; Supplier 1: Digi-Key; Supplier Part Number 1: P1.00KABCT-ND; VALUE: 1K_DNP; QCI Supplier: YGO
R26 R176 = R_1206_0: RES SMD 0.0 OHM JUMPER 1/4W 1206; MPN: RC1206JR-070RL; QPN: CS00006J248; QPN Description: RES CHIP 0 1/4W +-5%(1206); Function Code: USB; Supplier 1: Digi-Key; Supplier Part Number 1: 311-0.0ERCT-ND; QCI MPN: RC1206JR-070RL; QCI Supplier: YGO
  R26: VALUE: 0R
R28 R29 = R_0201_0: RES SMD 0.0OHM JUMPER 1/20W 0201; MPN: ERJ-1GN0R00C; QCI MPN: RC0201JR-130RL; QPN: CS00001JE18; QPN Description: RES CHIP 0(1/20W,+-5%,0201); Function Code: USB; Supplier 1: Digi-Key; Supplier Part Number 1: P15979CT-ND; VALUE: 0R; QCI Supplier: YGO
R32 R33 = R_0201_5.1K: RES SMD 5.1K OHM JUMPER 1/20W  0201; MPN: ERJ-JGEF5101C; QCI MPN: RC0201FR-075K1L; QPN: CS25101FE00; QPN Description: RES CHIP 5.1K 1/20W +-1%(0201); Function Code: USB; Supplier 1: Digi-Key; Supplier Part Number 1: P5.10KABCT-ND; VALUE: 5.1K; QCI Supplier: YGO
R98 R161 = R_0201_10K: RES SMD 10K OHM JUMPER 1/20W  0201; MPN: ERJ-1GEF103C; QCI MPN: RC0201JR-1310KL; QPN: CS31001JE16; QPN Description: RES CHIP 10K 1/20W +-5%(0201); Function Code: DCD; Supplier 1: Digi-Key; VALUE: 10K; Supplier Part Number 1: P10.0KABCT-ND; QCI Supplier: YGO
R162 = R_0402_0: RES SMD 0.0 OHM JUMPER 1/10W  0402; MPN: ERJ-2GE0R00X; QCI MPN: RC0402FR-070RL; QPN: CS00002FB00; QPN Description: RES CHIP 0 1/16W +-1%(0402); Function Code: USB; Supplier 1: Digi-Key; Supplier Part Number 1: P0.0JCT-ND; VALUE: 0R; QCI Supplier: YGO
TP6-TP8 TP22 TP27-TP29 TP36-TP44 TP50 TP51 = TP_L: TEST POINT (Large)
TP23-TP26 = TP: TEST POIN
U5 = PTN36043BX_DHXQFN18_23: IC USB TYPE-C SS ACTIVE DEMUX 1.8V DHXQFN18; QCI MPN: PTN36043BXY; Function Code: HUB; QPN: AL036043000; QPN Description: IC OTHER(18P)PTN36043BXY(DHX2QFN18); Supplier 1: Digi-Key; MPN: PTN36043BXZ; QCI Supplier: NXP
U6 U13 = NX5P3090UKZ_WLCSP12: Function Code: USB; QPN: AL003090U00; QPN Description: IC OTHER(12P) NX5P3090UK (WLCSP); Supplier 1: Digi-Key; MPN: NX5P3090UKZ; QCI MPN: NX5P3090UK; QCI Supplier: NXP
U7 = TPS61253A: QCI MPN: TPS61253AYFFR; Function Code: DCD; QPN: AL061253T00; QPN Description: IC OTHER(9P)TPS61253AYFFR(DSBGA); Supplier 1: Digi-Key; MPN: TPS61253AYFFT; QCI Supplier: TIC
U8 = PCMF3USB3S_A: Function Code: USB; QPN: CX3USB3S000; QPN Description: EMI FILTER PCMF3USB3S(3,100NA); Supplier 1: Digi-Key; MPN: PCMF3USB3SZ; QCI MPN: PCMF3USB3S; QCI Supplier: NXP
U9 = PTN5150A_X2QFN12: QPN: AL005150000; QPN Description: IC OTHER(12P)PTN5150AHXMP(X2QFN12); Function Code: HUB; Supplier 1: Digi-Key; Supplier Part Number 1: 568-13083-1-ND; MPN: PTN5150AHXMP; QCI MPN: PTN5150AHXMP; QCI Supplier: NXP
U14 = KTS1681A: USB Over Voltage, SUrge and ESD protection for VBUS, WCSP12; QPN: AL001681U00; QPN Description: IC OTHER(12P) KTS1681AEUZ-TR (WLCSP); MPN: KTS1681AEUZ-TR; QCI MPN: KTS1681AEUZ-TR; QCI Supplier: KNC; Function Code: USB
U16 = PCMF3USB3S_A: Function Code: HUB; QPN: CX3USB3S000; QPN Description: EMI FILTER PCMF3USB3S(3,100NA); Supplier 1: Digi-Key; MPN: PCMF3USB3SZ; QCI MPN: PCMF3USB3S; QCI Supplier: NXP
U17 = PCMF2USB3S_10P: QPN: CX2USB3S000; QPN Description: EMI FILTER PCMF2USB3S(3,100NA); Function Code: HUB; Supplier 1: Digi-Key; Supplier Part Number 1: 1727-2509-1-ND; MPN: PCMF2USB3S; QCI MPN: PCMF2USB3S; QCI Supplier: NXP